# Altium project BldcMotorDriverwithAtmega.PrjPcb
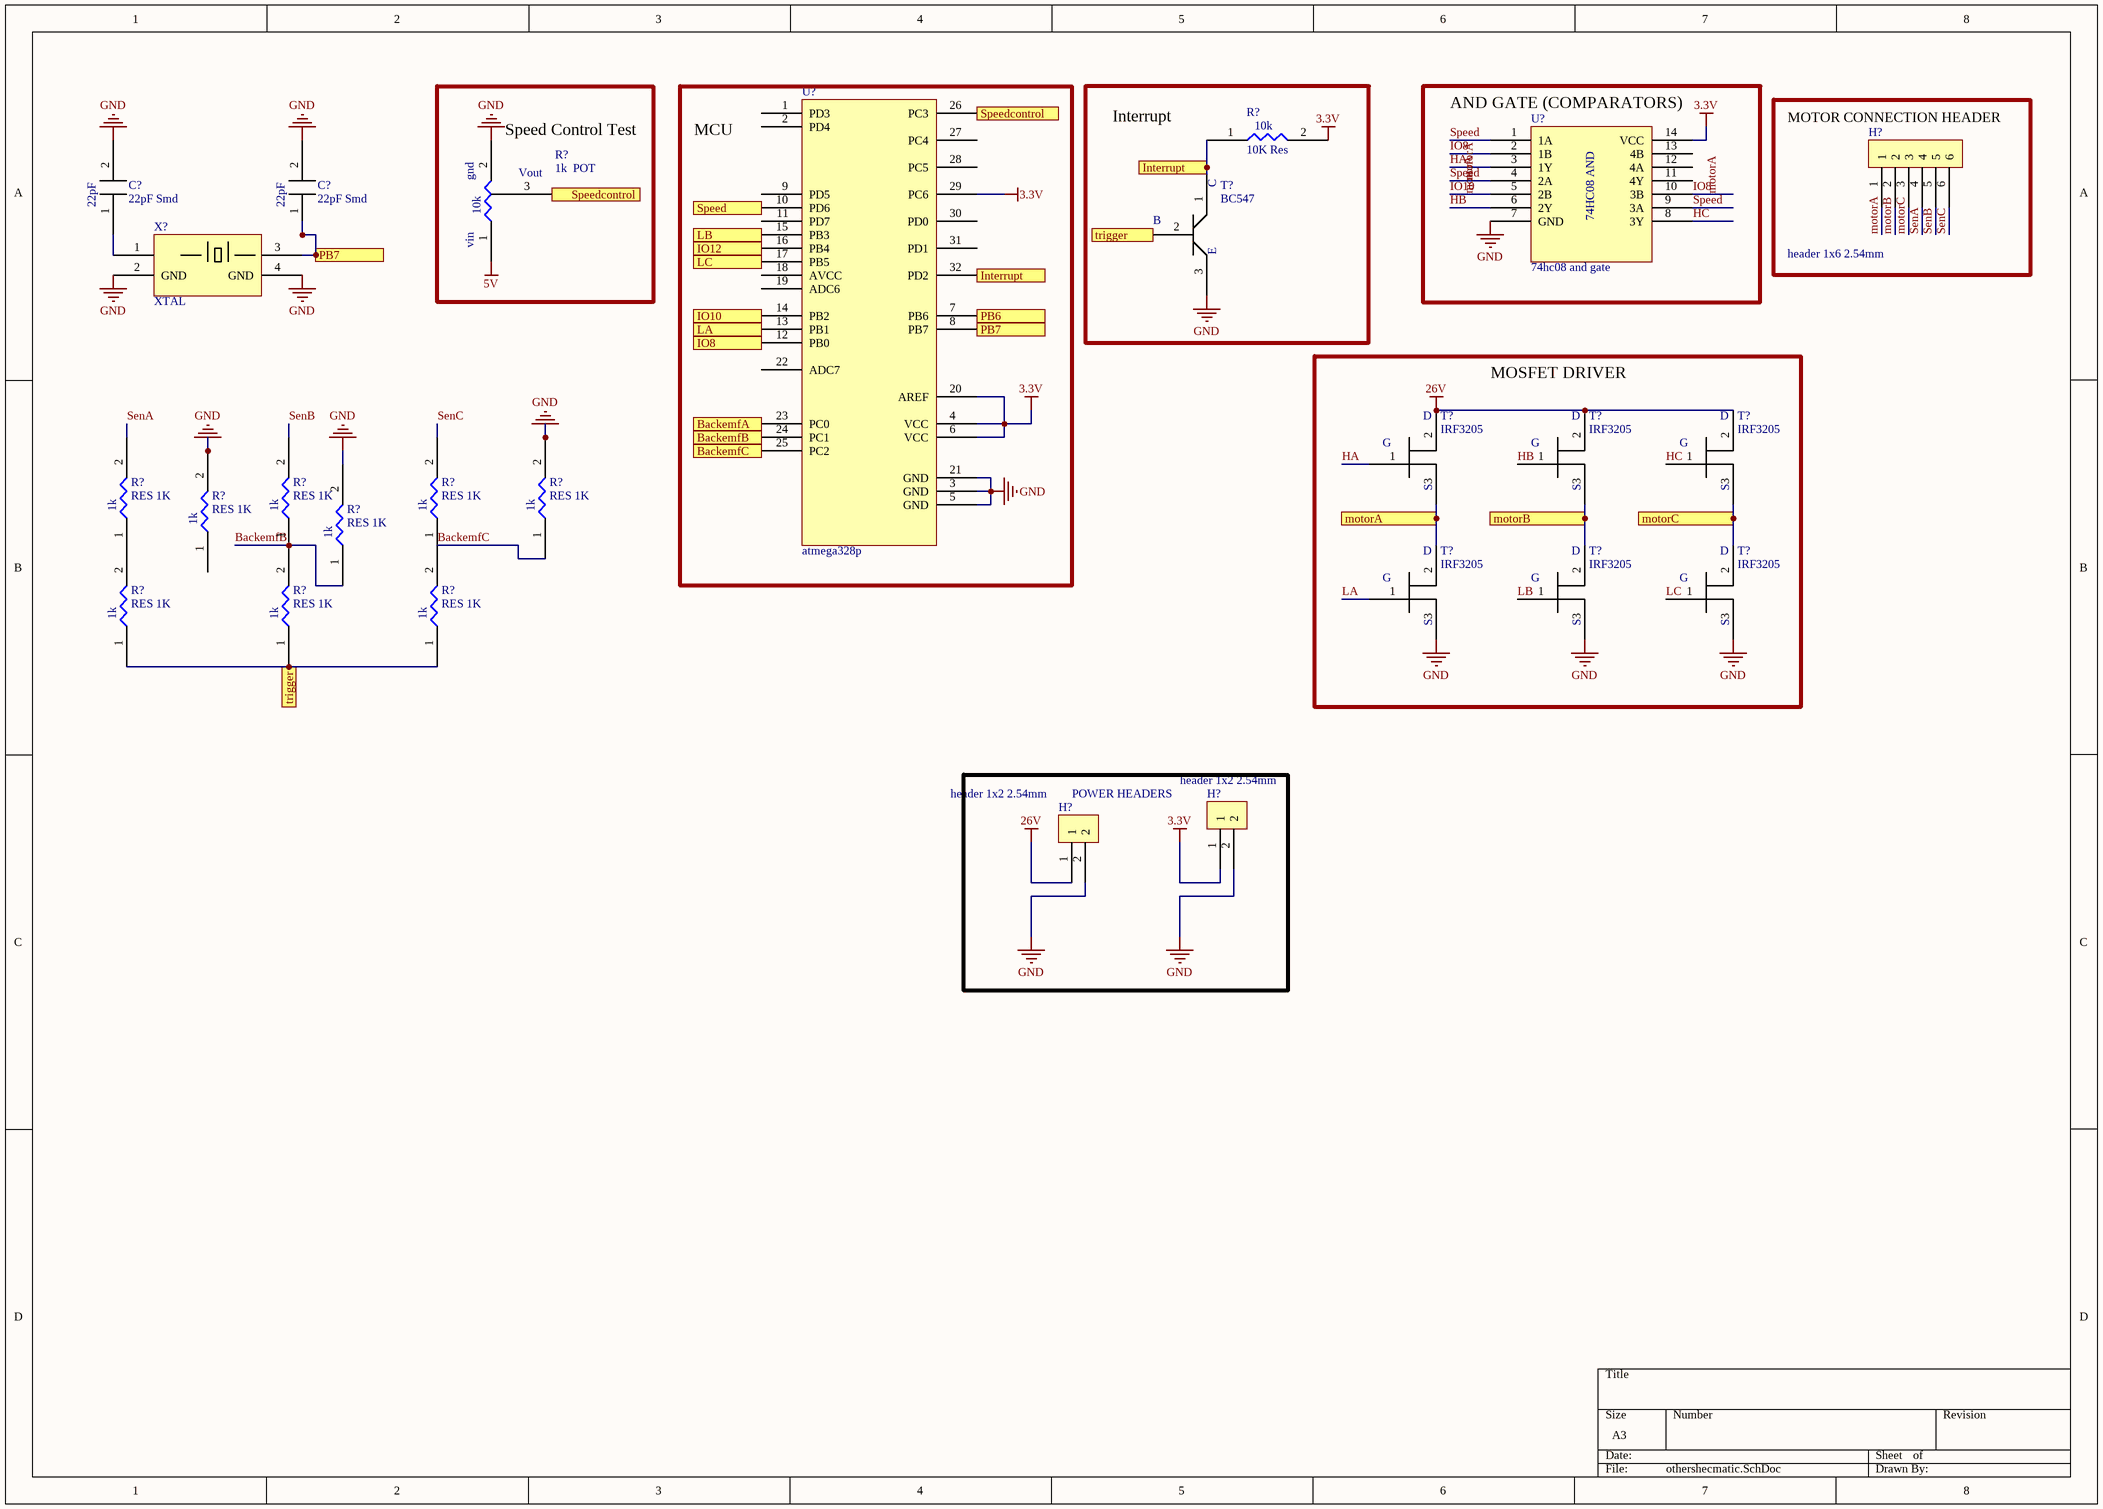
[diagram p0: othershecmatic.SchDoc]
2 sheets, 52 parts. Net scope: flat (ports and power ports of the same name join across sheets).
Board file: pcb.PcbDoc
Sheets:
  othershecmatic.SchDoc
  schematic.SchDoc

## Sheet othershecmatic.SchDoc
size A3

### Parts
(Parts that share a designator on the sheet are numbered #1, #2 ... from top to bottom, then left to right.)
C?#1  22pF Smd  [smd cap]
C?#2  22pF Smd  [smd cap]
H?#1  header 1x6 2.54mm  [Header 1x6 2.54mm]
H?#2  header 1x2 2.54mm  [HEADER 1X2 2.54mm]
H?#3  header 1x2 2.54mm  [HEADER 1X2 2.54mm]
R?#1  10K Res  [smd res]
R?#2  1k  POT  [smd trimpot]
R?#3  RES 1K  [smd res]
R?#4  RES 1K  [smd res]
R?#5  RES 1K  [smd res]
R?#6  RES 1K  [smd res]
R?#7  RES 1K  [smd res]
R?#8  RES 1K  [smd res]
R?#9  RES 1K  [smd res]
R?#10  RES 1K  [smd res]
R?#11  RES 1K  [smd res]
T?#1  BC547  [TO-92]
T?#2  IRF3205  [smd mosfet]
T?#3  IRF3205  [smd mosfet]
T?#4  IRF3205  [smd mosfet]
T?#5  IRF3205  [smd mosfet]
T?#6  IRF3205  [smd mosfet]
T?#7  IRF3205  [smd mosfet]
U?#1  74hc08 and gate  [SOIC127P1030X265-14N]
U?#2  atmega328p  [atmega238p]
X?  XTAL  [xtal]

### Ports
BackemfA, BackemfB, BackemfC, Interrupt, IO8, IO10, IO12, LA, LB, LC, motorA, motorB, motorC, PB6, PB7, Speed, Speedcontrol, trigger

### Nets
3.3V: H?#2.1 R?#1.2 U?#1.14(VCC) U?#2.4(VCC) U?#2.6(VCC) U?#2.20(AREF) U?#2.29(PC6)
5V: R?#2.1
26V: H?#3.1 T?#2.2 T?#3.2 T?#4.2
GND: C?#1.2 C?#2.2 H?#2.2 H?#3.2 R?#2.2(GND) R?#6.2 R?#7.2 R?#8.2 T?#1.3 T?#5.3 T?#6.3 T?#7.3 U?#1.7(GND) U?#2.3(GND) U?#2.5(GND) U?#2.21(GND) X?.2(GND) X?.4(GND)
BackemfB: R?#8.1 R?#10.2
BackemfC: R?#6.1 R?#11.2
HA: T?#2.1 U?#1.3(1Y)
HB: T?#3.1 U?#1.6(2Y)
HC: T?#4.1 U?#1.8(3Y)
IO10: H?#1.1 U?#1.1(1A) U?#1.2(1B) U?#1.4(2A) U?#1.5(2B) U?#1.9(3A) U?#1.10(3B)  [also labelled IO8, motorA, Speed]
LA: T?#5.1
LB: T?#6.1
LC: T?#7.1
motorB: H?#1.2
motorC: H?#1.3
SenA: H?#1.4 R?#3.2
SenB: H?#1.5 R?#4.2
SenC: H?#1.6 R?#5.2
NetC4_1: C?#2.1 U?#2.8(PB7) X?.3 ; port PB7
NetC?#1_1: C?#1.1 X?.1
NetH1_1: T?#2.3 T?#5.2 ; port motorA
NetH1_2: T?#3.3 T?#6.2 ; port motorB
NetH1_3: T?#4.3 T?#7.2 ; port motorC
NetR12_1: R?#1.1 T?#1.1 U?#2.32(PD2) ; port Interrupt
NetR13_3: R?#2.3 U?#2.26(PC3) ; port Speedcontrol
NetR20_1: R?#9.1 R?#10.1 R?#11.1 T?#1.2 ; port trigger
NetU3_7: U?#2.7(PB6) ; port PB6
NetU3_10: U?#2.10(PD6) ; port Speed
NetU3_12: U?#2.12(PB0) ; port IO8
NetU3_13: U?#2.13(PB1) ; port LA
NetU3_14: U?#2.14(PB2) ; port IO10
NetU3_15: U?#2.15(PB3) ; port LB
NetU3_16: U?#2.16(PB4) ; port IO12
NetU3_17: U?#2.17(PB5) ; port LC
NetU3_23: U?#2.23(PC0) ; port BackemfA
NetU3_24: U?#2.24(PC1) ; port BackemfB
NetU3_25: U?#2.25(PC2) ; port BackemfC

Not connected (* = marked no-connect by the designer): R?#3 1; R?#4 1; R?#5 1; R?#7 1; R?#9 2; U?#1 11(4Y) 12(4A) 13(4B); U?#2 1(PD3) 2(PD4) 9(PD5) 11(PD7) 18(AVCC) 19(ADC6) 22(ADC7) 27(PC4) 28(PC5) 30(PD0) 31(PD1)

### Notes on the sheet
- (near U?#1) AND GATE (COMPARATORS)
- (near R?#2) Speed Control Test
- MCU
- Interrupt
- (near H?#1) MOTOR CONNECTION HEADER
- MOSFET DRIVER
- (near H?#3) POWER HEADERS
- (in symbol 1k  POT) gnd; Vout; 10k; vin
- (in symbol 10K Res) 10k
- (in symbol 22pF Smd) 22pF
- (in symbol 74hc08 and gate) 74HC08 AND
- (in symbol BC547) C; B; E
- (in symbol IRF3205) D; G; S
- (in symbol RES 1K) 1k

### Library data of the parts
R?#1 = 10K Res: 10K SMD Res
R?#3-R?#11 = RES 1K: 1K Res
X? = XTAL: 16MHz Xtal

## Sheet schematic.SchDoc
size A3
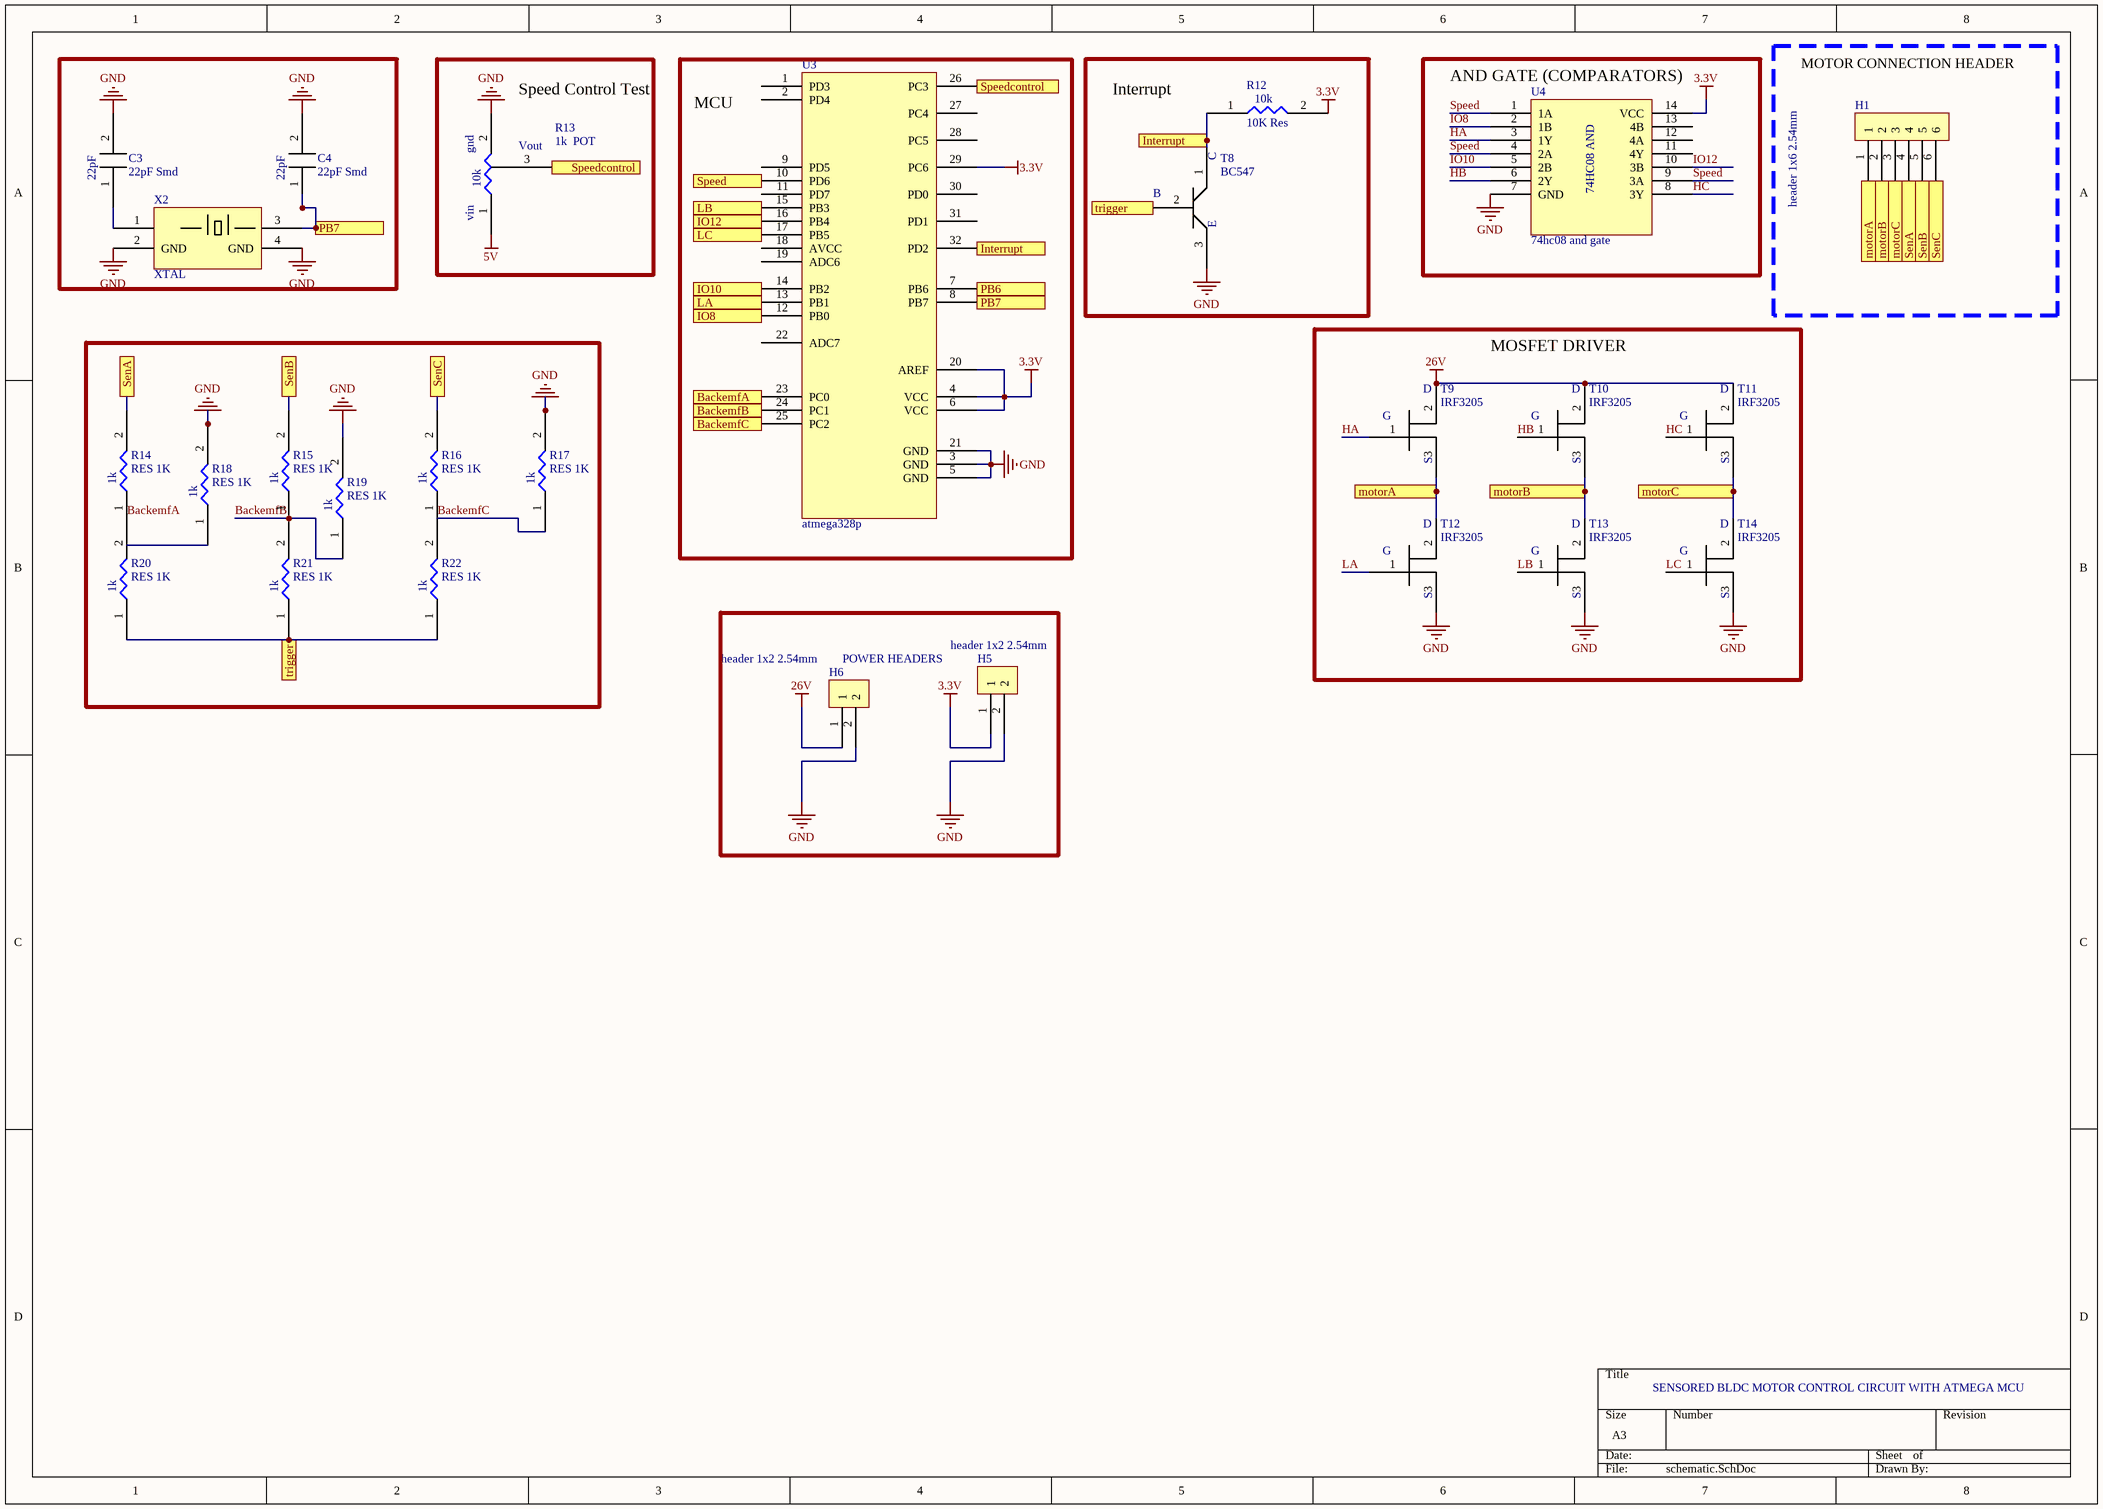
[diagram p1: schematic.SchDoc]

### Parts
C3  22pF Smd  [smd cap]
C4  22pF Smd  [smd cap]
H1  header 1x6 2.54mm  [Header 1x6 2.54mm]
H5  header 1x2 2.54mm  [HEADER 1X2 2.54mm]
H6  header 1x2 2.54mm  [HEADER 1X2 2.54mm]
R12  10K Res  [smd res]
R13  1k  POT  [smd trimpot]
R14  RES 1K  [smd res]
R15  RES 1K  [smd res]
R16  RES 1K  [smd res]
R17  RES 1K  [smd res]
R18  RES 1K  [smd res]
R19  RES 1K  [smd res]
R20  RES 1K  [smd res]
R21  RES 1K  [smd res]
R22  RES 1K  [smd res]
T8  BC547  [TO-92]
T9  IRF3205  [smd mosfet]
T10  IRF3205  [smd mosfet]
T11  IRF3205  [smd mosfet]
T12  IRF3205  [smd mosfet]
T13  IRF3205  [smd mosfet]
T14  IRF3205  [smd mosfet]
U3  atmega328p  [atmega238p]
U4  74hc08 and gate  [SOIC127P1030X265-14N]
X2  XTAL  [xtal]

### Ports
BackemfA (in), BackemfB (in), BackemfC (in), Interrupt, IO8, IO10, IO12, LA, LB, LC, motorA (in), motorA (out), motorB (in), motorB (out), motorC (in), motorC (out), PB6, PB7, SenA, SenA (in), SenB, SenB (in), SenC, SenC (in), Speed, Speedcontrol (in), Speedcontrol (out), trigger

### Nets
3.3V: H5.1 R12.2 U3.4(VCC) U3.6(VCC) U3.20(AREF) U3.29(PC6) U4.14(VCC)
5V: R13.1
26V: H6.1 T9.2 T10.2 T11.2
GND: C3.2 C4.2 H5.2 H6.2 R13.2(GND) R17.2 R18.2 R19.2 T8.3 T12.3 T13.3 T14.3 U3.3(GND) U3.5(GND) U3.21(GND) U4.7(GND) X2.2(GND) X2.4(GND)
BackemfA: R20.2
BackemfB: R19.1 R21.2
BackemfC: R17.1 R22.2
HA: T9.1 U4.3(1Y)
HB: T10.1 U4.6(2Y)
HC: T11.1 U4.8(3Y)
IO8: U4.2(1B)
IO10: U4.5(2B)
IO12: U4.10(3B)
LA: T12.1
LB: T13.1
LC: T14.1
Speed: U4.1(1A) U4.4(2A) U4.9(3A)
NetC3_1: C3.1 X2.1
NetC4_1: C4.1 U3.8(PB7) X2.3 ; port PB7
NetH1_1: H1.1 T9.3 T12.2 ; port motorA
NetH1_2: H1.2 T10.3 T13.2 ; port motorB
NetH1_3: H1.3 T11.3 T14.2 ; port motorC
NetH1_4: H1.4 R14.2 ; port SenA
NetH1_5: H1.5 R15.2 ; port SenB
NetH1_6: H1.6 R16.2 ; port SenC
NetR12_1: R12.1 T8.1 U3.32(PD2) ; port Interrupt
NetR13_3: R13.3 U3.26(PC3) ; port Speedcontrol
NetR20_1: R20.1 R21.1 R22.1 T8.2 ; port trigger
NetU3_7: U3.7(PB6) ; port PB6
NetU3_10: U3.10(PD6) ; port Speed
NetU3_12: U3.12(PB0) ; port IO8
NetU3_13: U3.13(PB1) ; port LA
NetU3_14: U3.14(PB2) ; port IO10
NetU3_15: U3.15(PB3) ; port LB
NetU3_16: U3.16(PB4) ; port IO12
NetU3_17: U3.17(PB5) ; port LC
NetU3_23: U3.23(PC0) ; port BackemfA
NetU3_24: U3.24(PC1) ; port BackemfB
NetU3_25: U3.25(PC2) ; port BackemfC

Not connected (* = marked no-connect by the designer): R14 1; R15 1; R16 1; R18 1; U3 1(PD3) 2(PD4) 9(PD5) 11(PD7) 18(AVCC) 19(ADC6) 22(ADC7) 27(PC4) 28(PC5) 30(PD0) 31(PD1); U4 11(4Y) 12(4A) 13(4B)

### Notes on the sheet
- Speed Control Test
- MCU
- Interrupt
- (near U4) AND GATE (COMPARATORS)
- MOTOR CONNECTION HEADER
- MOSFET DRIVER
- (near H6) POWER HEADERS
- SENSORED BLDC MOTOR CONTROL CIRCUIT WITH ATMEGA MCU
- (in symbol 1k  POT) gnd; Vout; 10k; vin
- (in symbol 10K Res) 10k
- (in symbol 22pF Smd) 22pF
- (in symbol 74hc08 and gate) 74HC08 AND
- (in symbol BC547) C; B; E
- (in symbol IRF3205) D; G; S
- (in symbol RES 1K) 1k

### Library data of the parts
R12 = 10K Res: 10K SMD Res
R14-R22 = RES 1K: 1K Res
X2 = XTAL: 16MHz Xtal

## Nets that join several sheets
3.3V: othershecmatic (7 pins), schematic (7 pins)
5V: othershecmatic (R?#2.1), schematic (R13.1)
26V: othershecmatic (H?#3.1 T?#2.2 T?#3.2 T?#4.2), schematic (H6.1 T9.2 T10.2 T11.2)
GND: othershecmatic (18 pins), schematic (18 pins)
NetC4_1: othershecmatic (C?#2.1 U?#2.8 X?.3), schematic (C4.1 U3.8 X2.3)
NetH1_1: othershecmatic (T?#2.3 T?#5.2), schematic (H1.1 T9.3 T12.2)
NetH1_2: othershecmatic (T?#3.3 T?#6.2), schematic (H1.2 T10.3 T13.2)
NetH1_3: othershecmatic (T?#4.3 T?#7.2), schematic (H1.3 T11.3 T14.2)
NetR12_1: othershecmatic (R?#1.1 T?#1.1 U?#2.32), schematic (R12.1 T8.1 U3.32)
NetR13_3: othershecmatic (R?#2.3 U?#2.26), schematic (R13.3 U3.26)
NetR20_1: othershecmatic (R?#9.1 R?#10.1 R?#11.1 T?#1.2), schematic (R20.1 R21.1 R22.1 T8.2)
NetU3_7: othershecmatic (U?#2.7), schematic (U3.7)
NetU3_10: othershecmatic (U?#2.10), schematic (U3.10)
NetU3_12: othershecmatic (U?#2.12), schematic (U3.12)
NetU3_13: othershecmatic (U?#2.13), schematic (U3.13)
NetU3_14: othershecmatic (U?#2.14), schematic (U3.14)
NetU3_15: othershecmatic (U?#2.15), schematic (U3.15)
NetU3_16: othershecmatic (U?#2.16), schematic (U3.16)
NetU3_17: othershecmatic (U?#2.17), schematic (U3.17)
NetU3_23: othershecmatic (U?#2.23), schematic (U3.23)
NetU3_24: othershecmatic (U?#2.24), schematic (U3.24)
NetU3_25: othershecmatic (U?#2.25), schematic (U3.25)